# Altium schematic sheet B2B_Connector.SchDoc
size 436 x 289 mm; CompanyName: Zohm Control GmbH; Address1: Rittersbacher Straße 48c; Address2: 91126 Schwabach; Address3: GERMANY; DocumentNumber: 4; SheetNumber: 4; SheetTotal: 30; Website: www.zohm-control.com
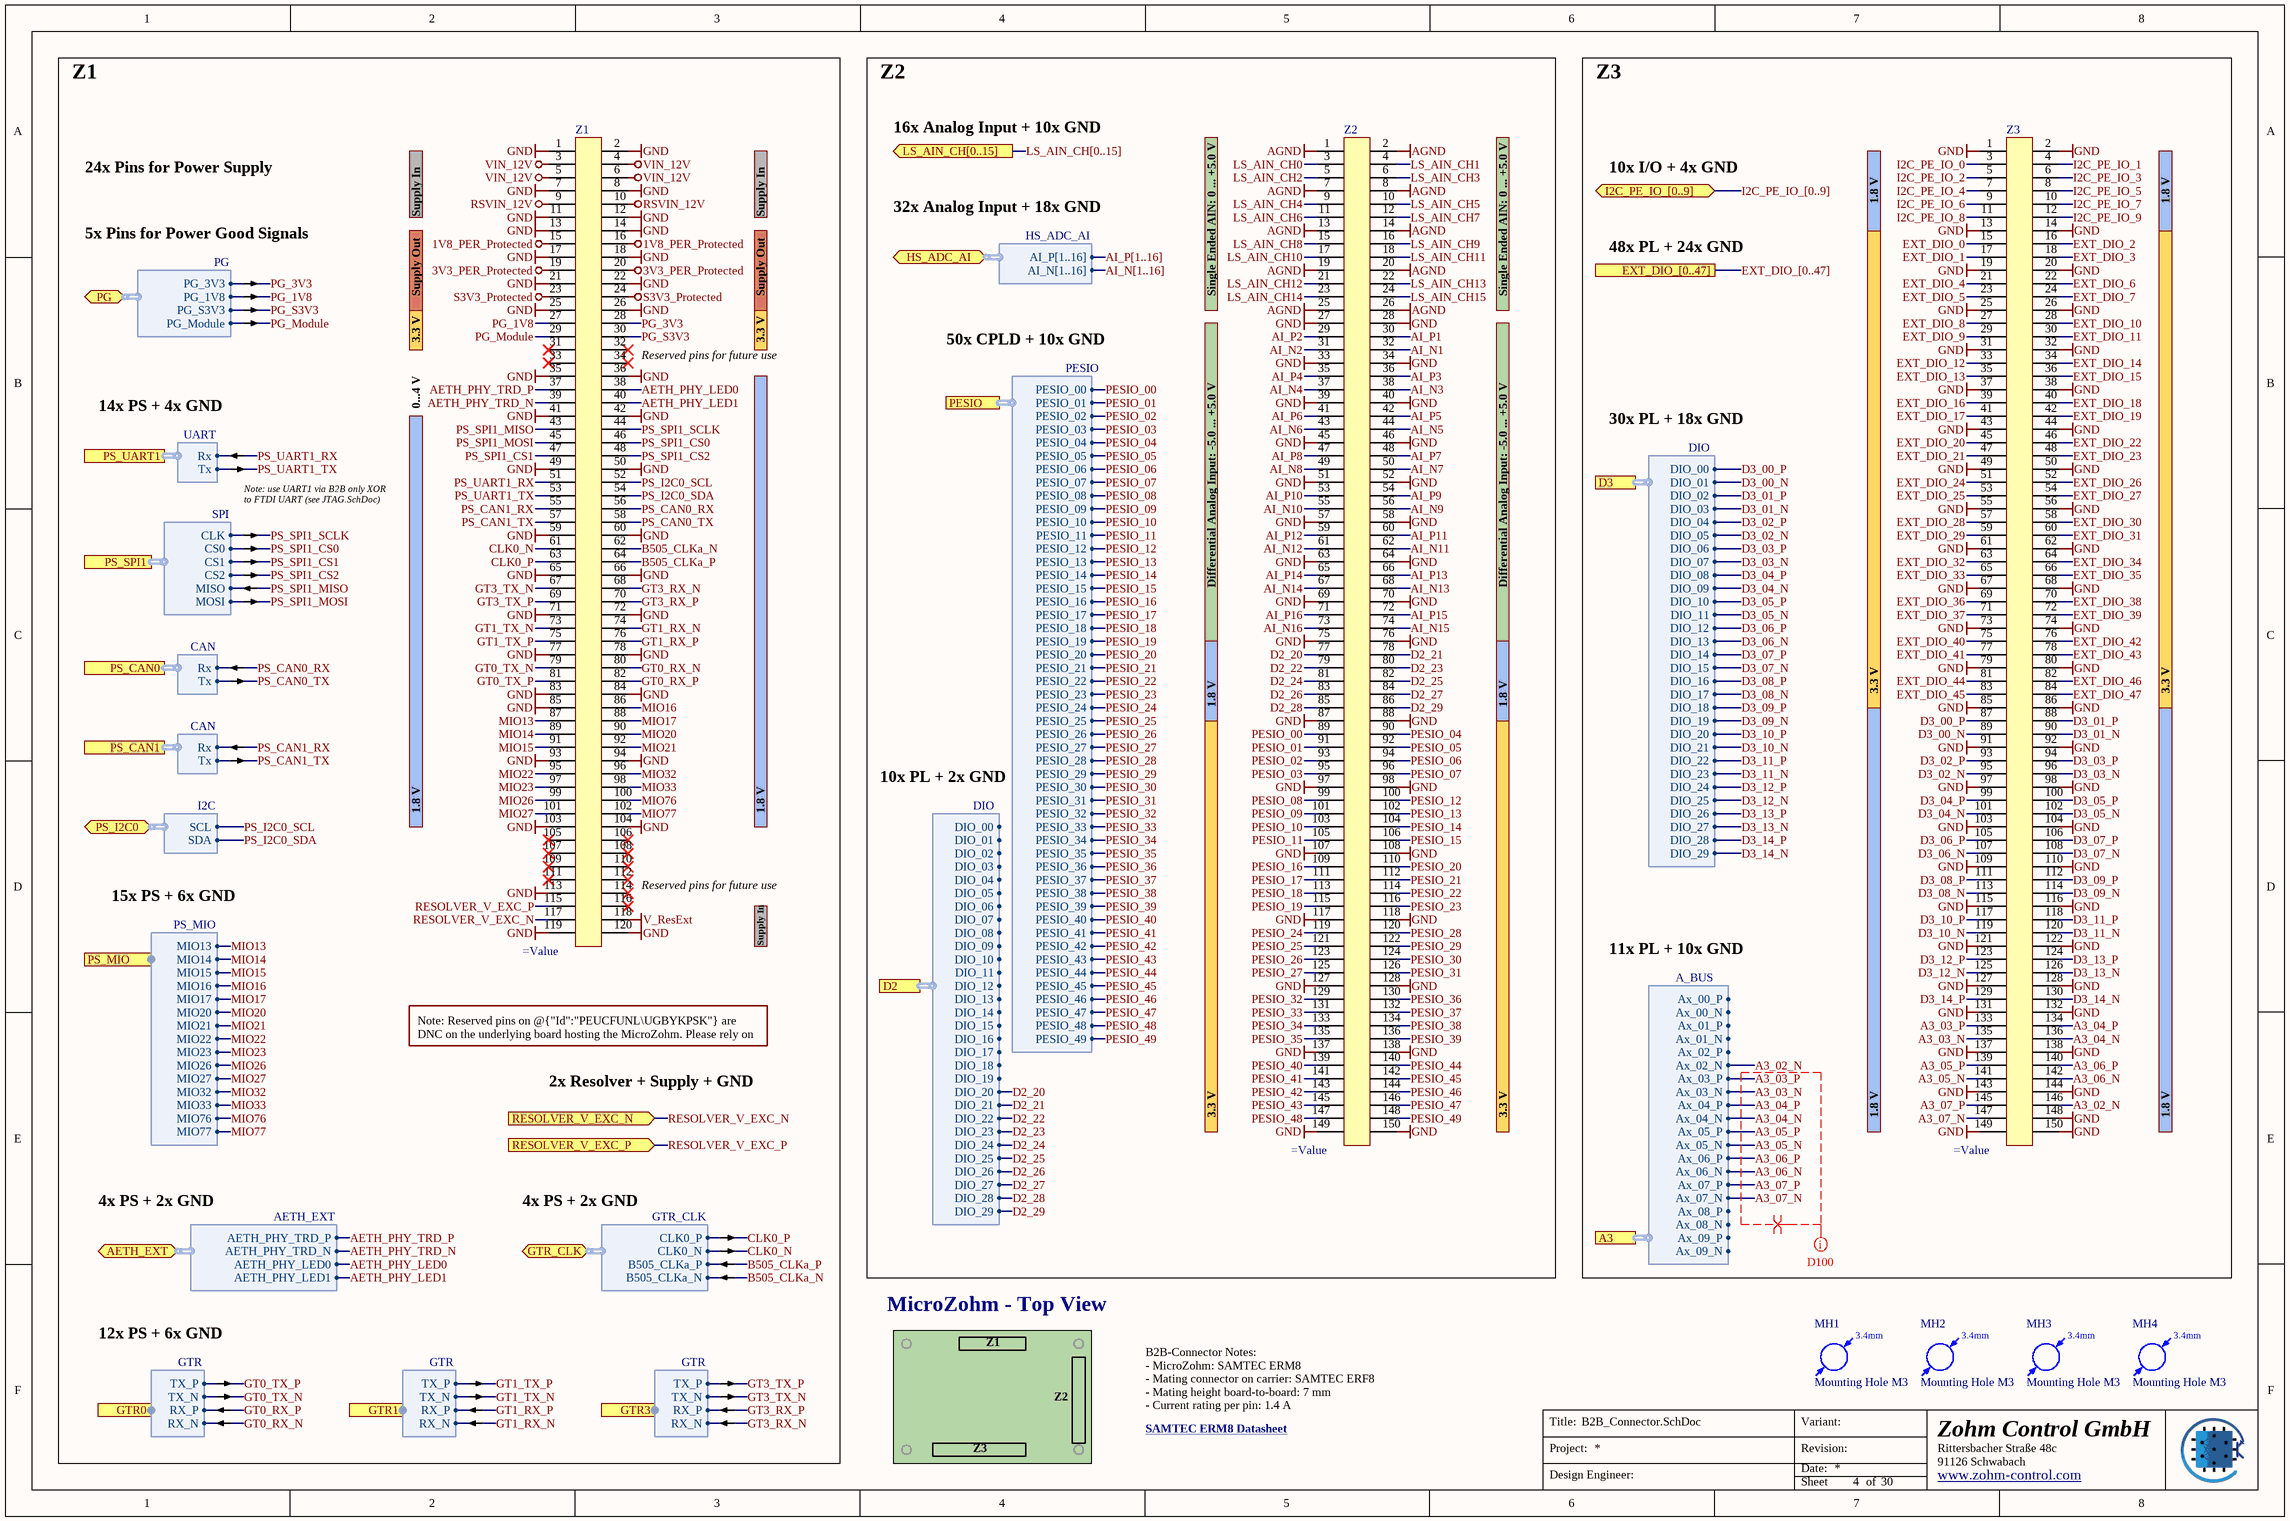
[diagram p0: B2B_Connector.SchDoc]

## Parts
MH1  Mounting Hole M3  [MH_3.4]  (no BOM)
MH2  Mounting Hole M3  [MH_3.4]  (no BOM)
MH3  Mounting Hole M3  [MH_3.4]  (no BOM)
MH4  Mounting Hole M3  [MH_3.4]  (no BOM)
Z1  (no value)  [ERM8-060-02.0-L-DV]
Z2  (no value)  [ERM8-075-02.0-L-DV]
Z3  (no value)  [ERM8-075-02.0-L-DV]

## Blocks framed on the sheet
Z1: Z1
Z2: Z2
Z3: Z3

## Ports
A3 (harness A_BUS), AETH_EXT (bidir, harness AETH_EXT), D2 (harness DIO), D3 (harness DIO), EXT_DIO_[0..47], GTR0 (harness GTR), GTR1 (harness GTR), GTR3 (harness GTR), GTR_CLK (bidir, harness GTR_CLK), HS_ADC_AI (bidir, harness HS_ADC_AI), I2C_PE_IO_[0..9] (bidir), LS_AIN_CH[0..15] (out), PESIO (harness PESIO), PG (bidir, harness PG), PS_CAN0 (harness CAN), PS_CAN1 (harness CAN), PS_I2C0 (bidir, harness I2C), PS_MIO (harness PS_MIO), PS_SPI1 (harness SPI), PS_UART1 (harness UART), RESOLVER_V_EXC_N (in), RESOLVER_V_EXC_P (in)

## Harnesses
HS_ADC_AI: AI_P[1..16], AI_N[1..16]
CAN: Rx, Tx
PESIO: PESIO_00, PESIO_01, PESIO_02, PESIO_03, PESIO_04, PESIO_05, PESIO_06, PESIO_07, PESIO_08, PESIO_09, PESIO_10, PESIO_11, PESIO_12, PESIO_13, PESIO_14, PESIO_15, PESIO_16, PESIO_17, PESIO_18, PESIO_19, PESIO_20, PESIO_21, PESIO_22, PESIO_23, PESIO_24, PESIO_25, PESIO_26, PESIO_27, PESIO_28, PESIO_29, PESIO_30, PESIO_31, PESIO_32, PESIO_33, PESIO_34, PESIO_35, PESIO_36, PESIO_37, PESIO_38, PESIO_39, PESIO_40, PESIO_41, PESIO_42, PESIO_43, PESIO_44, PESIO_45, PESIO_46, PESIO_47, PESIO_48, PESIO_49
DIO: DIO_00, DIO_01, DIO_02, DIO_03, DIO_04, DIO_05, DIO_06, DIO_07, DIO_08, DIO_09, DIO_10, DIO_11, DIO_12, DIO_13, DIO_14, DIO_15, DIO_16, DIO_17, DIO_18, DIO_19, DIO_20, DIO_21, DIO_22, DIO_23, DIO_24, DIO_25, DIO_26, DIO_27, DIO_28, DIO_29
GTR: RX_N, RX_P, TX_N, TX_P
AETH_EXT: AETH_PHY_TRD_P, AETH_PHY_TRD_N, AETH_PHY_LED0, AETH_PHY_LED1
UART: Rx, Tx
A_BUS: Ax_00_N, Ax_00_P, Ax_01_N, Ax_01_P, Ax_02_N, Ax_02_P, Ax_03_N, Ax_03_P, Ax_04_N, Ax_04_P, Ax_05_N, Ax_05_P, Ax_06_N, Ax_06_P, Ax_07_N, Ax_07_P, Ax_08_N, Ax_08_P, Ax_09_N, Ax_09_P
PG: PG_Module, PG_1V8, PG_S3V3, PG_3V3
GTR_CLK: CLK0_N, CLK0_P, B505_CLKa_P, B505_CLKa_N
I2C: SCL, SDA
PS_MIO: MIO14, MIO15, MIO13, MIO16, MIO17, MIO20, MIO21, MIO22, MIO23, MIO26, MIO27, MIO32, MIO33, MIO76, MIO77
SPI: CLK, CS0, MISO, MOSI, CS1, CS2

## Nets
1V8_PER_Protected: Z1.15 Z1.16
3V3_PER_Protected: Z1.19 Z1.20
AGND: Z2.1 Z2.2 Z2.7 Z2.8 Z2.13 Z2.14 Z2.19 Z2.20 Z2.25 Z2.26
GND: Z1.1 Z1.2 Z1.7 Z1.8 Z1.11 Z1.12 Z1.13 Z1.14 Z1.17 Z1.18 Z1.21 Z1.22 Z1.25 Z1.26 Z1.35 Z1.36 Z1.41 Z1.42 Z1.49 Z1.50 Z1.59 Z1.60 Z1.65 Z1.66 Z1.71 Z1.72 Z1.77 Z1.78 Z1.83 Z1.84 Z1.85 Z1.93 Z1.94 Z1.103 Z1.104 Z1.113 Z1.119 Z1.120 Z2.27 Z2.28 Z2.33 Z2.34 Z2.39 Z2.40 Z2.45 Z2.46 Z2.51 Z2.52 Z2.57 Z2.58 Z2.63 Z2.64 Z2.69 Z2.70 Z2.75 Z2.76 Z2.87 Z2.88 Z2.97 Z2.98 Z2.107 Z2.108 Z2.117 Z2.118 Z2.127 Z2.128 Z2.137 Z2.138 Z2.149 Z2.150 Z3.1 Z3.2 Z3.13 Z3.14 Z3.19 Z3.20 Z3.25 Z3.26 Z3.31 Z3.32 Z3.37 Z3.38 Z3.43 Z3.44 Z3.49 Z3.50 Z3.55 Z3.56 Z3.61 Z3.62 Z3.67 Z3.68 Z3.73 Z3.74 Z3.79 Z3.80 Z3.85 Z3.86 Z3.91 Z3.92 Z3.97 Z3.98 Z3.103 Z3.104 Z3.109 Z3.110 Z3.115 Z3.116 Z3.121 Z3.122 Z3.127 Z3.128 Z3.131 Z3.132 Z3.137 Z3.138 Z3.143 Z3.144 Z3.148 Z3.149 Z3.150
RSVIN_12V: Z1.9 Z1.10
S3V3_Protected: Z1.23 Z1.24
V_ResExt: Z1.118
VIN_12V: Z1.3 Z1.4 Z1.5 Z1.6
A3_02_N: Z3.146 ; port A3.Ax_02_N
A3_03_N: Z3.135 ; port A3.Ax_03_N
A3_03_P: Z3.133 ; port A3.Ax_03_P
A3_04_N: Z3.136 ; port A3.Ax_04_N
A3_04_P: Z3.134 ; port A3.Ax_04_P
A3_05_N: Z3.141 ; port A3.Ax_05_N
A3_05_P: Z3.139 ; port A3.Ax_05_P
A3_06_N: Z3.142 ; port A3.Ax_06_N
A3_06_P: Z3.140 ; port A3.Ax_06_P
A3_07_N: Z3.147 ; port A3.Ax_07_N
A3_07_P: Z3.145 ; port A3.Ax_07_P
AETH_PHY_LED0: Z1.38 ; port AETH_EXT.AETH_PHY_LED0
AETH_PHY_LED1: Z1.40 ; port AETH_EXT.AETH_PHY_LED1
AETH_PHY_TRD_N: Z1.39 ; port AETH_EXT.AETH_PHY_TRD_N
AETH_PHY_TRD_P: Z1.37 ; port AETH_EXT.AETH_PHY_TRD_P
AI_N1: Z2.32
AI_N2: Z2.31
AI_N3: Z2.38
AI_N4: Z2.37
AI_N5: Z2.44
AI_N6: Z2.43
AI_N7: Z2.50
AI_N8: Z2.49
AI_N9: Z2.56
AI_N10: Z2.55
AI_N11: Z2.62
AI_N12: Z2.61
AI_N13: Z2.68
AI_N14: Z2.67
AI_N15: Z2.74
AI_N16: Z2.73
AI_P1: Z2.30
AI_P2: Z2.29
AI_P3: Z2.36
AI_P4: Z2.35
AI_P5: Z2.42
AI_P6: Z2.41
AI_P7: Z2.48
AI_P8: Z2.47
AI_P9: Z2.54
AI_P10: Z2.53
AI_P11: Z2.60
AI_P12: Z2.59
AI_P13: Z2.66
AI_P14: Z2.65
AI_P15: Z2.72
AI_P16: Z2.71
B505_CLKa_N: Z1.62 ; port GTR_CLK.B505_CLKa_N
B505_CLKa_P: Z1.64 ; port GTR_CLK.B505_CLKa_P
CLK0_N: Z1.61 ; port GTR_CLK.CLK0_N
CLK0_P: Z1.63 ; port GTR_CLK.CLK0_P
D2_20: Z2.77 ; port D2.DIO_20
D2_21: Z2.78 ; port D2.DIO_21
D2_22: Z2.79 ; port D2.DIO_22
D2_23: Z2.80 ; port D2.DIO_23
D2_24: Z2.81 ; port D2.DIO_24
D2_25: Z2.82 ; port D2.DIO_25
D2_26: Z2.83 ; port D2.DIO_26
D2_27: Z2.84 ; port D2.DIO_27
D2_28: Z2.85 ; port D2.DIO_28
D2_29: Z2.86 ; port D2.DIO_29
D3_00_N: Z3.89 ; port D3.DIO_01
D3_00_P: Z3.87 ; port D3.DIO_00
D3_01_N: Z3.90 ; port D3.DIO_03
D3_01_P: Z3.88 ; port D3.DIO_02
D3_02_N: Z3.95 ; port D3.DIO_05
D3_02_P: Z3.93 ; port D3.DIO_04
D3_03_N: Z3.96 ; port D3.DIO_07
D3_03_P: Z3.94 ; port D3.DIO_06
D3_04_N: Z3.101 ; port D3.DIO_09
D3_04_P: Z3.99 ; port D3.DIO_08
D3_05_N: Z3.102 ; port D3.DIO_11
D3_05_P: Z3.100 ; port D3.DIO_10
D3_06_N: Z3.107 ; port D3.DIO_13
D3_06_P: Z3.105 ; port D3.DIO_12
D3_07_N: Z3.108 ; port D3.DIO_15
D3_07_P: Z3.106 ; port D3.DIO_14
D3_08_N: Z3.113 ; port D3.DIO_17
D3_08_P: Z3.111 ; port D3.DIO_16
D3_09_N: Z3.114 ; port D3.DIO_19
D3_09_P: Z3.112 ; port D3.DIO_18
D3_10_N: Z3.119 ; port D3.DIO_21
D3_10_P: Z3.117 ; port D3.DIO_20
D3_11_N: Z3.120 ; port D3.DIO_23
D3_11_P: Z3.118 ; port D3.DIO_22
D3_12_N: Z3.125 ; port D3.DIO_25
D3_12_P: Z3.123 ; port D3.DIO_24
D3_13_N: Z3.126 ; port D3.DIO_27
D3_13_P: Z3.124 ; port D3.DIO_26
D3_14_N: Z3.130 ; port D3.DIO_29
D3_14_P: Z3.129 ; port D3.DIO_28
EXT_DIO_0: Z3.15
EXT_DIO_1: Z3.17
EXT_DIO_2: Z3.16
EXT_DIO_3: Z3.18
EXT_DIO_4: Z3.21
EXT_DIO_5: Z3.23
EXT_DIO_6: Z3.22
EXT_DIO_7: Z3.24
EXT_DIO_8: Z3.27
EXT_DIO_9: Z3.29
EXT_DIO_10: Z3.28
EXT_DIO_11: Z3.30
EXT_DIO_12: Z3.33
EXT_DIO_13: Z3.35
EXT_DIO_14: Z3.34
EXT_DIO_15: Z3.36
EXT_DIO_16: Z3.39
EXT_DIO_17: Z3.41
EXT_DIO_18: Z3.40
EXT_DIO_19: Z3.42
EXT_DIO_20: Z3.45
EXT_DIO_21: Z3.47
EXT_DIO_22: Z3.46
EXT_DIO_23: Z3.48
EXT_DIO_24: Z3.51
EXT_DIO_25: Z3.53
EXT_DIO_26: Z3.52
EXT_DIO_27: Z3.54
EXT_DIO_28: Z3.57
EXT_DIO_29: Z3.59
EXT_DIO_30: Z3.58
EXT_DIO_31: Z3.60
EXT_DIO_32: Z3.63
EXT_DIO_33: Z3.65
EXT_DIO_34: Z3.64
EXT_DIO_35: Z3.66
EXT_DIO_36: Z3.69
EXT_DIO_37: Z3.71
EXT_DIO_38: Z3.70
EXT_DIO_39: Z3.72
EXT_DIO_40: Z3.75
EXT_DIO_41: Z3.77
EXT_DIO_42: Z3.76
EXT_DIO_43: Z3.78
EXT_DIO_44: Z3.81
EXT_DIO_45: Z3.83
EXT_DIO_46: Z3.82
EXT_DIO_47: Z3.84
GT0_RX_N: Z1.80 ; port GTR0.RX_N
GT0_RX_P: Z1.82 ; port GTR0.RX_P
GT0_TX_N: Z1.79 ; port GTR0.TX_N
GT0_TX_P: Z1.81 ; port GTR0.TX_P
GT1_RX_N: Z1.74 ; port GTR1.RX_N
GT1_RX_P: Z1.76 ; port GTR1.RX_P
GT1_TX_N: Z1.73 ; port GTR1.TX_N
GT1_TX_P: Z1.75 ; port GTR1.TX_P
GT3_RX_N: Z1.68 ; port GTR3.RX_N
GT3_RX_P: Z1.70 ; port GTR3.RX_P
GT3_TX_N: Z1.67 ; port GTR3.TX_N
GT3_TX_P: Z1.69 ; port GTR3.TX_P
I2C_PE_IO_0: Z3.3
I2C_PE_IO_1: Z3.4
I2C_PE_IO_2: Z3.5
I2C_PE_IO_3: Z3.6
I2C_PE_IO_4: Z3.7
I2C_PE_IO_5: Z3.8
I2C_PE_IO_6: Z3.9
I2C_PE_IO_7: Z3.10
I2C_PE_IO_8: Z3.11
I2C_PE_IO_9: Z3.12
LS_AIN_CH0: Z2.3
LS_AIN_CH1: Z2.4
LS_AIN_CH2: Z2.5
LS_AIN_CH3: Z2.6
LS_AIN_CH4: Z2.9
LS_AIN_CH5: Z2.10
LS_AIN_CH6: Z2.11
LS_AIN_CH7: Z2.12
LS_AIN_CH8: Z2.15
LS_AIN_CH9: Z2.16
LS_AIN_CH10: Z2.17
LS_AIN_CH11: Z2.18
LS_AIN_CH12: Z2.21
LS_AIN_CH13: Z2.22
LS_AIN_CH14: Z2.23
LS_AIN_CH15: Z2.24
MIO13: Z1.87 ; port PS_MIO.MIO13
MIO14: Z1.89 ; port PS_MIO.MIO14
MIO15: Z1.91 ; port PS_MIO.MIO15
MIO16: Z1.86 ; port PS_MIO.MIO16
MIO17: Z1.88 ; port PS_MIO.MIO17
MIO20: Z1.90 ; port PS_MIO.MIO20
MIO21: Z1.92 ; port PS_MIO.MIO21
MIO22: Z1.95 ; port PS_MIO.MIO22
MIO23: Z1.97 ; port PS_MIO.MIO23
MIO26: Z1.99 ; port PS_MIO.MIO26
MIO27: Z1.101 ; port PS_MIO.MIO27
MIO32: Z1.96 ; port PS_MIO.MIO32
MIO33: Z1.98 ; port PS_MIO.MIO33
MIO76: Z1.100 ; port PS_MIO.MIO76
MIO77: Z1.102 ; port PS_MIO.MIO77
PESIO_00: Z2.89 ; port PESIO.PESIO_00
PESIO_01: Z2.91 ; port PESIO.PESIO_01
PESIO_02: Z2.93 ; port PESIO.PESIO_02
PESIO_03: Z2.95 ; port PESIO.PESIO_03
PESIO_04: Z2.90 ; port PESIO.PESIO_04
PESIO_05: Z2.92 ; port PESIO.PESIO_05
PESIO_06: Z2.94 ; port PESIO.PESIO_06
PESIO_07: Z2.96 ; port PESIO.PESIO_07
PESIO_08: Z2.99 ; port PESIO.PESIO_08
PESIO_09: Z2.101 ; port PESIO.PESIO_09
PESIO_10: Z2.103 ; port PESIO.PESIO_10
PESIO_11: Z2.105 ; port PESIO.PESIO_11
PESIO_12: Z2.100 ; port PESIO.PESIO_12
PESIO_13: Z2.102 ; port PESIO.PESIO_13
PESIO_14: Z2.104 ; port PESIO.PESIO_14
PESIO_15: Z2.106 ; port PESIO.PESIO_15
PESIO_16: Z2.109 ; port PESIO.PESIO_16
PESIO_17: Z2.111 ; port PESIO.PESIO_17
PESIO_18: Z2.113 ; port PESIO.PESIO_18
PESIO_19: Z2.115 ; port PESIO.PESIO_19
PESIO_20: Z2.110 ; port PESIO.PESIO_20
PESIO_21: Z2.112 ; port PESIO.PESIO_21
PESIO_22: Z2.114 ; port PESIO.PESIO_22
PESIO_23: Z2.116 ; port PESIO.PESIO_23
PESIO_24: Z2.119 ; port PESIO.PESIO_24
PESIO_25: Z2.121 ; port PESIO.PESIO_25
PESIO_26: Z2.123 ; port PESIO.PESIO_26
PESIO_27: Z2.125 ; port PESIO.PESIO_27
PESIO_28: Z2.120 ; port PESIO.PESIO_28
PESIO_29: Z2.122 ; port PESIO.PESIO_29
PESIO_30: Z2.124 ; port PESIO.PESIO_30
PESIO_31: Z2.126 ; port PESIO.PESIO_31
PESIO_32: Z2.129 ; port PESIO.PESIO_32
PESIO_33: Z2.131 ; port PESIO.PESIO_33
PESIO_34: Z2.133 ; port PESIO.PESIO_34
PESIO_35: Z2.135 ; port PESIO.PESIO_35
PESIO_36: Z2.130 ; port PESIO.PESIO_36
PESIO_37: Z2.132 ; port PESIO.PESIO_37
PESIO_38: Z2.134 ; port PESIO.PESIO_38
PESIO_39: Z2.136 ; port PESIO.PESIO_39
PESIO_40: Z2.139 ; port PESIO.PESIO_40
PESIO_41: Z2.141 ; port PESIO.PESIO_41
PESIO_42: Z2.143 ; port PESIO.PESIO_42
PESIO_43: Z2.145 ; port PESIO.PESIO_43
PESIO_44: Z2.140 ; port PESIO.PESIO_44
PESIO_45: Z2.142 ; port PESIO.PESIO_45
PESIO_46: Z2.144 ; port PESIO.PESIO_46
PESIO_47: Z2.146 ; port PESIO.PESIO_47
PESIO_48: Z2.147 ; port PESIO.PESIO_48
PESIO_49: Z2.148 ; port PESIO.PESIO_49
PG_1V8: Z1.27 ; port PG.PG_1V8
PG_3V3: Z1.28 ; port PG.PG_3V3
PG_Module: Z1.29 ; port PG.PG_Module
PG_S3V3: Z1.30 ; port PG.PG_S3V3
PS_CAN0_RX: Z1.56 ; port PS_CAN0.Rx
PS_CAN0_TX: Z1.58 ; port PS_CAN0.Tx
PS_CAN1_RX: Z1.55 ; port PS_CAN1.Rx
PS_CAN1_TX: Z1.57 ; port PS_CAN1.Tx
PS_I2C0_SCL: Z1.52 ; port PS_I2C0.SCL
PS_I2C0_SDA: Z1.54 ; port PS_I2C0.SDA
PS_SPI1_CS0: Z1.46 ; port PS_SPI1.CS0
PS_SPI1_CS1: Z1.47 ; port PS_SPI1.CS1
PS_SPI1_CS2: Z1.48 ; port PS_SPI1.CS2
PS_SPI1_MISO: Z1.43 ; port PS_SPI1.MISO
PS_SPI1_MOSI: Z1.45 ; port PS_SPI1.MOSI
PS_SPI1_SCLK: Z1.44 ; port PS_SPI1.CLK
PS_UART1_RX: Z1.51 ; port PS_UART1.Rx
PS_UART1_TX: Z1.53 ; port PS_UART1.Tx
RESOLVER_V_EXC_N: Z1.117 ; port RESOLVER_V_EXC_N
RESOLVER_V_EXC_P: Z1.115 ; port RESOLVER_V_EXC_P

Not connected (* = marked no-connect by the designer): Z1 31* 32* 33* 34* 105* 106* 107* 108* 109* 110* 111* 112* 114* 116*

## Buses and harness runs
bus AI_N[1..16]
bus AI_P[1..16]
bus EXT_DIO_[0..47] = port EXT_DIO_[0..47]
bus I2C_PE_IO_[0..9] = port I2C_PE_IO_[0..9]
bus LS_AIN_CH[0..15] = port LS_AIN_CH[0..15]

## Layout directives
differential pair: A3_03_N, A3_03_P, A3_04_N, A3_04_P, A3_05_N, A3_05_P, A3_06_N, A3_06_P, A3_07_N, A3_07_P
net class D100: A3_03_N, A3_03_P, A3_04_N, A3_04_P, A3_05_N, A3_05_P, A3_06_N, A3_06_P, A3_07_N, A3_07_P

## Notes on the sheet
- 16x Analog Input + 10x GND
- 24x Pins for Power Supply
- Supply In
- 32x Analog Input + 18x GND
- 10x I/O + 4x GND
- 1.8 V
- 5x Pins for Power Good Signals
- 48x PL + 24x GND
- 3.3 V
- Supply Out
- 50x CPLD + 10x GND
- Single Ended AIN: 0 ... +5.0 V
- 14x PS + 4x GND
- 0...4 V
- (near Z1) Reserved pins for future use
- 30x PL + 18x GND
- Note: use UART1 via B2B only XOR to FTDI UART (see JTAG.SchDoc)
- Differential Analog Input: -5.0 ... +5.0 V
- 10x PL + 2x GND
- 15x PS + 6x GND
- 11x PL + 10x GND
- Note: Reserved pins on @{"Id":"PEUCFUNL\UGBYKPSK"} are DNC on the underlying board hosting the MicroZohm. Please rely on Zohm Control's ZC23002 as reference.
- 2x Resolver + Supply + GND
- 4x PS + 2x GND
- 12x PS + 6x GND
- MicroZohm - Top View
- Z1
- Z2
- B2B-Connector Notes:
  - MicroZohm: SAMTEC ERM8
  - Mating connector on carrier: SAMTEC ERF8
  - Mating height board-to-board: 7 mm
  - Current rating per pin: 1.4 A
- Z3
- SAMTEC ERM8 Datasheet <https://suddendocs.samtec.com/productspecs/erm8-erf8.pdf>
- Title:
- Project:
- Date:
- Revision:
- Variant:
- Design Engineer:
- Sheet
- of
- (in symbol Mounting Hole) 3.4mm

## Library data of the parts
MH1-MH4 = Mounting Hole: Created from: MHlatky; Manufacturer Part Number: Mounting Hole M3; PartID: 16; Created On: 26.01.2021 09:19:51; ComponentLink1Description: Datasheet; Component Type: Mounting Hole; Device Package: -; Last Updated: 21.03.2022 23:05:12; Manufacturer: Mounting Hole; Supplier 1: Mounting Hole; Supplier Part Number 1: Mounting Hole; Type: Mounting Hole; Value: Mounting Hole; Live Cycle Status: 1; Stock number: not stored
Z1 = ERM8-060-02.0-L-DV-TR: 0.80 mm Edge Rate Rugged High Speed; Manufacturer: SAMTEC; Created from: AGeiger; Manufacturer Part Number: ERM8-060-02.0-L-DV-TR; PartID: 61; Created On: 15.08.2025 09:35:44; ComponentLink1Description: Datasheet; ComponentLink1URL: https://suddendocs.samtec.com/catalog_english/erm8.pdf; Last Updated: 23.09.2025 10:14:21; Mounting Type: SMD; Operating Temperature: -55 °C to +125 °C; Series: ERM8; Supplier 1: LCSC; Supplier Part Number 1: C3649339; Value: ERM8-060-02.0-L-DV-TR; LCSC Part Number: C3649339
Z2 Z3 = ERM8-075-02.0-L-DV-TR: 0.80 mm Edge Rate Rugged High Speed; Manufacturer: SAMTEC; Created from: AGeiger; Value: ERM8-075-02.0-L-DV-TR; Manufacturer Part Number: ERM8-075-02.0-L-DV-TR; PartID: 62; Created On: 15.08.2025 09:35:44; ComponentLink1Description: Datasheet; ComponentLink1URL: https://suddendocs.samtec.com/catalog_english/erm8.pdf; Last Updated: 23.09.2025 10:14:21; Mounting Type: SMD; Operating Temperature: -55 °C to +125 °C; Series: ERM8; Supplier 1: LCSC; Supplier Part Number 1: C6845629; LCSC Part Number: C6845629